# Altium schematic sheet MCU.SchDoc
size A; SheetNumber: 2; SheetTotal: 3
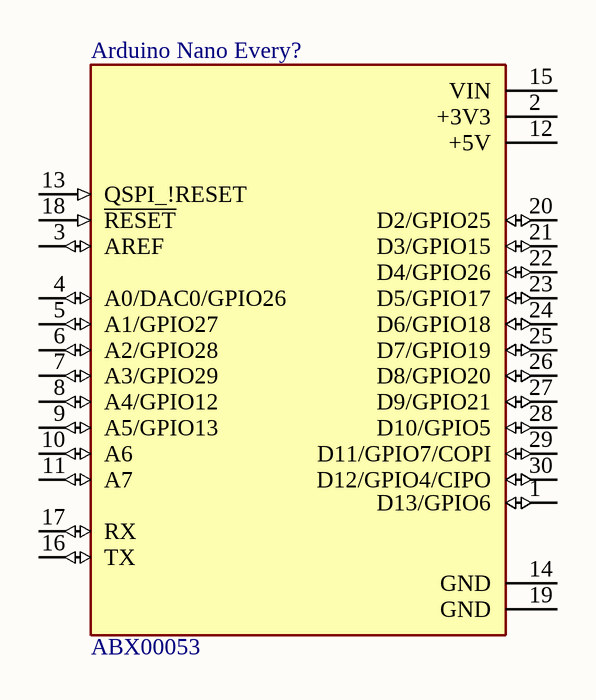
[diagram p0: MCU.SchDoc]

## Parts
Arduino_Nano_Every?  ABX00053  [Arduino Nano Every]

## Nets

Not connected (* = marked no-connect by the designer): Arduino_Nano_Every? 1(D13/GPIO6) 2(+3V3) 3(AREF) 4(A0/DAC0/GPIO26) 5(A1/GPIO27) 6(A2/GPIO28) 7(A3/GPIO29) 8(A4/GPIO12) 9(A5/GPIO13) 10(A6) 11(A7) 12(+5V) 13(QSPI_!RESET) 14(GND) 15(VIN) 16(TX) 17(RX) 18(~{RESET}) 19(GND) 20(D2/GPIO25) 21(D3/GPIO15) 22(D4/GPIO26) 23(D5/GPIO17) 24(D6/GPIO18) 25(D7/GPIO19) 26(D8/GPIO20) 27(D9/GPIO21) 28(D10/GPIO5) 29(D11/GPIO7/COPI) 30(D12/GPIO4/CIPO)

## Library data of the parts
Arduino_Nano_Every? = ABX00053: ARDUINO NANO RP2040 CONNECT WITH; MF: {'manufacturer': u'Arduino'}; Package: None; Value: *; MP: ABX00053; Availability: Unavailable; Price: None